# EAGLE design brushless sub driver 2 (EAGLE 9.6.2)
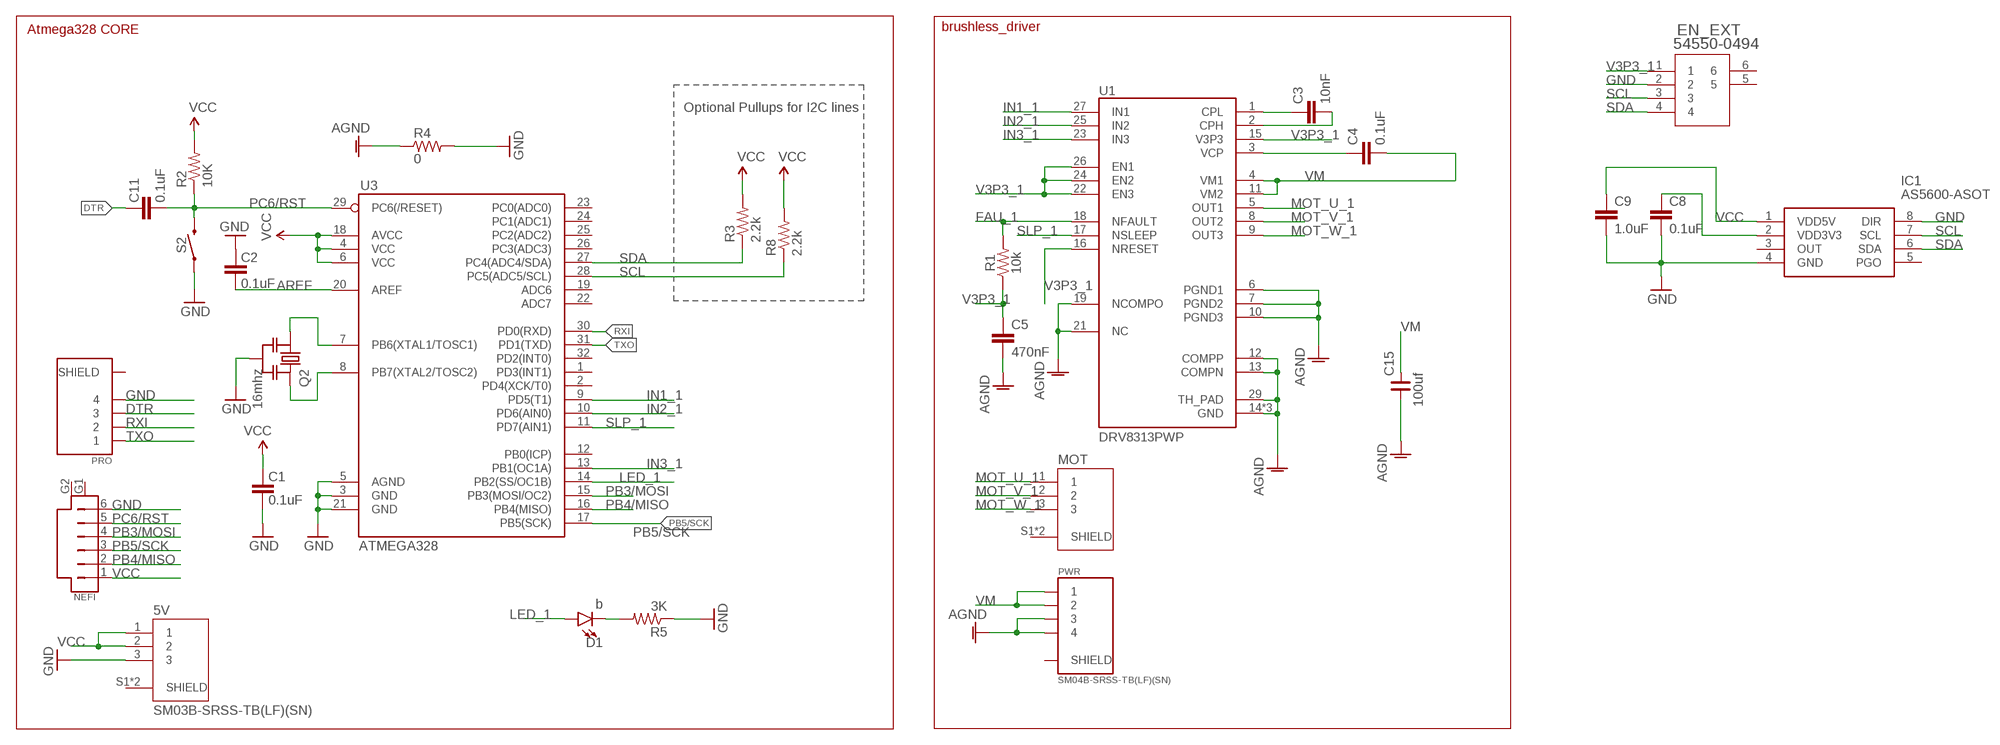
[diagram p0: schematic, sheet 1]

## Parts
5V  SM03B-SRSS-TB(LF)(SN)  [JST_SM03B-SRSS-TB(LF)(SN)]
C1  0.1uF  CAP0603-CAP  [0603-CAP]
C2  0.1uF  CAP0603-CAP  [0603-CAP]
C3  10nF  10NF-0603-50V-10%  [0603]
C4  0.1uF  0.1UF-0603-25V-(+80/-20%)  [0603]
C5  470nF  470NF-0603-10V-10%-X5R  [0603]
C8  0.1uF  0.1UF-0402-16V-10%  [0402]
C9  1.0uF  1.0UF-0402-16V-10%  [0402]
C11  0.1uF  CAP0603-CAP  [0603-CAP]
C15  100uf  C_1206  [C1206]
D1  b  LED0603  [LED-0603]
EN_EXT  54550-0494  [CON4_1X4_DRB2_MOL]
IC1  AS5600-ASOT  [SOIC127P600X175-8N]
MOT  SM03B-SRSS-TB(LF)(SN)  [JST_SM03B-SRSS-TB(LF)(SN)]
NEFI  SM06B-SRSS-TB  [SM06B]
PRO  SM04B-SRSS-TB(LF)(SN)  [JST_SM04B-SRSS-TB(LF)(SN)]
PWR  SM04B-SRSS-TB(LF)(SN)  [JST_SM04B-SRSS-TB(LF)(SN)]
Q2  16mhz  RESONATOR-MURATACST_CE  [RESONATOR_MURATA2]
R1  10k  10KOHM-0603-1/10W-1%  [0603]
R2  10K  RESISTOR0603-RES  [0603-RES]
R3  2.2k  RESISTOR0603-RES  [0603-RES]
R4  0  R_0603  [R0603]
R5  3K  RESISTOR0603-RES  [0603-RES]
R8  2.2k  RESISTOR0603-RES  [0603-RES]
S2  MOMENTARY-SWITCH-SPST-SMD-RIGHT-ANGLE  [TACTILE_SWITCH_SMD_RIGHT_ANGLE]
U1  DRV8313PWP  [SOP28P65_970X640X120L60X24T483X275N]
U3  ATMEGA328  ATMEGA168  [TQFP32-08]

## Nets
AGND: C5.2 C15.1 PWR.3 PWR.4 R4.1 U1.6(PGND1) U1.7(PGND2) U1.10(PGND3) U1.12(COMPP) U1.13(COMPN) U1.14(GND) U1.19(NCOMPO) U1.20(GND) U1.21(NC) U1.28(GND) U1.29(TH_PAD)
AREF: C2.1 U3.20(AREF)
DTR: C11.2 PRO.3
FAU_1: R1.2 U1.18(NFAULT)
GND: 5V.3 C1.1 C2.2 C8.2 C9.2 EN_EXT.2 IC1.4(GND) IC1.8(DIR) NEFI.6 PRO.4 Q2.2 R4.2 R5.1 S2.1 U3.3(GND) U3.5(AGND) U3.21(GND)
IN1_1: U1.27(IN1) U3.9(PD5(T1))
IN2_1: U1.25(IN2) U3.10(PD6(AIN0))
IN3_1: U1.23(IN3) U3.13(PB1(OC1A))
LED_1: D1.A U3.14(PB2(SS/OC1B))
MOT_U_1: MOT.1 U1.5(OUT1)
MOT_V_1: MOT.2 U1.8(OUT2)
MOT_W_1: MOT.3 U1.9(OUT3)
N$1: Q2.1 U3.7(PB6(XTAL1/TOSC1))
N$2: Q2.3 U3.8(PB7(XTAL2/TOSC2))
N$3: C3.1 U1.1(CPL)
N$4: C3.2 U1.2(CPH)
N$5: C4.1 U1.3(VCP)
N$6: C8.1 IC1.2(VDD3V3)
N$7: D1.C R5.2
PB3/MOSI: NEFI.4 U3.15(PB3(MOSI/OC2))
PB4/MISO: NEFI.2 U3.16(PB4(MISO))
PB5/SCK: NEFI.3 U3.17(PB5(SCK))
PC6/RST: C11.1 NEFI.5 R2.1 S2.2 U3.29(PC6(/RESET))
RXI: PRO.2 U3.30(PD0(RXD))
SCL: EN_EXT.3 IC1.7(SCL) R8.1 U3.28(PC5(ADC5/SCL))
SDA: EN_EXT.4 IC1.6(SDA) R3.1 U3.27(PC4(ADC4/SDA))
SLP_1: U1.17(NSLEEP) U3.11(PD7(AIN1))
TXO: PRO.1 U3.31(PD1(TXD))
V3P3_1: C5.1 EN_EXT.1 R1.1 U1.15(V3P3) U1.16(NRESET) U1.22(EN3) U1.24(EN2) U1.26(EN1)
VCC: 5V.1 5V.2 C1.2 C9.1 IC1.1(VDD5V) NEFI.1 R2.2 R3.2 R8.2 U3.4(VCC) U3.6(VCC) U3.18(AVCC)
VM: C4.2 C15.2 PWR.1 PWR.2 U1.4(VM1) U1.11(VM2)
Unconnected: 5V.S1(SHIELD) 5V.S2(SHIELD) EN_EXT.5 EN_EXT.6 IC1.3(OUT) IC1.5(PGO) MOT.S1(SHIELD) MOT.S2(SHIELD) NEFI.G1 NEFI.G2 PRO.S1(SHIELD) PRO.S2(SHIELD) PWR.S1(SHIELD) PWR.S2(SHIELD) U3.1(PD3(INT1)) U3.2(PD4(XCK/T0)) U3.12(PB0(ICP)) U3.19(ADC6) U3.22(ADC7) U3.23(PC0(ADC0)) U3.24(PC1(ADC1)) U3.25(PC2(ADC2)) U3.26(PC3(ADC3)) U3.32(PD2(INT0))

## Notes on the sheet
- Atmega328 CORE | brushless_driver
- Optional Pullups for I2C lines

## Library data of the parts
5V MOT = SM03B-SRSS-TB_LF__SN_:SM03B-SRSS-TB(LF)(SN): SH Series 3 Position 1 mm Pitch Surface Mount Side Entry Shrouded Header; AVAILABILITY: Unavailable; DESCRIPTION: Connector Header Surface Mount, Right Angle 3 position 0.039 _1.00mm_; MF: JST Sales; MP: SM03B-SRSS-TB_LF__SN_; PACKAGE: None; PRICE: None
C1 C2 C11 = SparkFun:CAP: Capacitor Standard 0603 ceramic capacitor, and 0.1" leaded capacitor.
C3 = SparkFun-Capacitors:10NF: 0.01uF/10nF/10,000pF ceramic capacitors A capacitor is a passive two-terminal electrical component used to store electrical energy temporarily in an electric field. CAP-09321; PROD_ID: CAP-00867
C4 = SparkFun-Capacitors:0.1UF: 0.1µF ceramic capacitors A capacitor is a passive two-terminal electrical component used to store electrical energy temporarily in an electric field.; PROD_ID: CAP-00810
C5 = SparkFun-Capacitors:470NF: 0.47uF/470nF ceramic capacitors A capacitor is a passive two-terminal electrical component used to store electrical energy temporarily in an electric field.; PROD_ID: CAP-13216
C8 = SparkFun-Capacitors:0.1UF: 0.1µF ceramic capacitors A capacitor is a passive two-terminal electrical component used to store electrical energy temporarily in an electric field.; PROD_ID: CAP-12416
C9 = SparkFun-Capacitors:1.0UF: 1µF ceramic capacitors A capacitor is a passive two-terminal electrical component used to store electrical energy temporarily in an electric field.; PROD_ID: CAP-12417
C15 = rc-master-smd:C_: NON-POLARIZED CAP
D1 = SparkFun-LED:LED: LED (Generic) Standard schematic elements and footprints for 5mm, 3mm, 1206, and 0603 sized LEDs. Generic LEDs with no color specified.
EN_EXT = fpc_4p_0.5:54550-0494; BUILT_BY: EMA_UL_Team; MANUFACTURER_PART_NUMBER: 54550-0494; SOURCELIBRARY: Molex_2010-01-01; VENDOR: Molex Connector Corporation
IC1 = AS5600-ASOT:AS5600-ASOT: Board Mount Hall Effect / Magnetic Sensors AS5600 Magnetic Sensor 12-Bit Source: Datasheet <http://www.ams.com/eng/content/download/639463/1698857/325295>; DESCRIPTION: Board Mount Hall Effect / Magnetic Sensors AS5600 Magnetic Sensor 12-Bit; HEIGHT: 1.75mm; MANUFACTURER_NAME: ams; MANUFACTURER_PART_NUMBER: AS5600-ASOT; MOUSER_PART_NUMBER: 985-AS5600-ASOT; MOUSER_PRICE-STOCK: https://www.mouser.com/Search/Refine.aspx?Keyword=985-AS5600-ASOT
NEFI = SM06B-SRSS-TB:SM06B-SRSS-TB: CONN HEADER SH 6POS SIDE 1MM TIN Check prices <https://snapeda.com/parts/SM06B-SRSS-TB/JST%20Sales/view-part/?ref=eda>; AVAILABILITY: Bad; DESCRIPTION: Connector Header Surface Mount, Right Angle 6 position 0.039 (1.00mm); MF: JST Sales; MP: SM06B-SRSS-TB; PACKAGE: None; PRICE: None
PRO PWR = SM04B-SRSS-TB_LF__SN_:SM04B-SRSS-TB(LF)(SN): SH Series 1.0 mm Pitch 2 Position Single Row Side Entry Shrouded Header Check prices <https://snapeda.com/parts/SM04B-SRSS-TB%28LF%29%28SN%29/JST%20Sales/view-part/?ref=eda>; ARROW_EUROPE-PURCHASE-URL: https://snapeda.com/shop?store=Arrow+Europe&id=557466; AVAILABILITY: Good; DESCRIPTION: Connector Header Surface Mount, Right Angle 4 position 0.039 (1.00mm); DIGIKEY-PURCHASE-URL: https://snapeda.com/shop?store=DigiKey&id=557466; MF: JST Sales; MP: SM04B-SRSS-TB(LF)(SN); PACKAGE: None; PRICE: None
Q2 = m-pad-2.1:RESONATOR-MURATA: Murata ceramic Resonator "ceralock" CSTCE series with built in load capacitance +- 0.5% tolerance 12.51MHz to 19.99MHz 16MHz murata part#: CSTCE16M0V53-R0 16MHz digikey part#: 490-1198-1-ND $1.33 each
R1 = SparkFun-Resistors:10KOHM: 10kΩ resistor A resistor is a passive two-terminal electrical component that implements electrical resistance as a circuit element. Resistors act to reduce current flow, and, at the same time, act to lower voltage levels within circuits. - Wikipedia; PROD_ID: RES-00824
R2 R3 R5 R8 = SparkFun:RESISTOR: Resistor Basic schematic elements and footprints for 0603, 1206, and PTH resistors.
R4 = rc-master-smd:R_: RESISTOR
S2 = SparkFun-Switches:MOMENTARY-SWITCH-SPST: Momentary Switch (Pushbutton) - SPST Normally-open (NO) SPST momentary switches (buttons, pushbuttons). Variants PTH-12MM - 12mm square, through-hole Momentary Pushbutton Switch - 12mm Square <https://www.sparkfun.com/products/9190> (COM-09190) PTH-6.0MM, PTH-6.0MM-KIT - 6.0mm square, through-hole Mini Pushbutton Switch <https://www.sparkfun.com/products/97> (COM-00097) KIT package intended for soldering kit's - only one side of pads' copper is exposed. PTH-RIGHT-ANGLE-KIT - Right-angle, through-hole Right Angle Tactile Button <https://www.sparkfun.com/products/10791> - Used on SparkFun BigTime Watch Kit <https://www.sparkfun.com/products/11734> SMD-12MM - 12mm square, surface-mount Tactile Button - SMD (12mm) <https://www.sparkfun.com/products/12993> (COM-12993) Used on SparkFun PicoBoard <https://www.sparkfun.com/products/11888> SMD-4.5MM - 4.5mm Square Trackball Switch Used on SparkFun Blackberry Trackballer Breakout <https://www.sparkfun.com/products/13169> SMD-4.6MMX2.8MM - 4.60mm x 2.80mm, surface mount Used on SparkFun SAMD21 Mini Breakout <https://www.sparkfun.com/products/13664> SMD-5.2MM, SMD-5.2-REDUNDANT - 5.2mm square, surface-mount Mini Pushbutton Switch - SMD <https://www.sparkfun.com/products/8720> (COM-08720) Used on Arduino Pro Mini <https://www.sparkfun.com/products/11114> REDUNDANT package connects both switch circuits together SMD-6.0X3.5MM - 6.0 x 3.5mm, surface mount Momentary Reset Switch SMD <https://www.sparkfun.com/products/8229> (COM-08229) SMD-6.2MM-TALL - 6.2mm square, surface mount Tactile Button - SMD (6mm) <https://www.sparkfun.com/products/12992> Used on SparkFun Digital Sandbox <https://www.sparkfun.com/products/12651> SMD-RIGHT-ANGLE - Right-angle, surface mount Used on SparkFun Block for Intel® Edison - Arduino <https://www.sparkfun.com/products/13036>; PROD_ID: COMP-12265
U1 = DRV8313PWP:DRV8313PWP: 2.5A Three Phase Brushless DC Motor Driver (PWM Ctrl) 28-HTSSOP -40 to 85; DESCRIPTION: 2.5A Three Phase Brushless DC Motor Driver _PWM Ctrl_ 28-HTSSOP -40 to 85; DIGI-KEY_PART_NUMBER: 296-35540-5-ND; DIGI-KEY_PURCHASE_URL: https://www.digikey.com.cn/product-detail/zh/texas-instruments/DRV8313PWP/296-35540-5-ND/3790947?utm_source=snapeda&utm_medium=aggregator&utm_campaign=symbol; MF: Texas Instruments; MP: DRV8313PWP; PACKAGE: HTSSOP-28 Texas Instruments
U3 = SparkFun:ATMEGA168

## Net classes
0 default: width 0.203 mm
1 vcc: width 0.254 mm

## Board
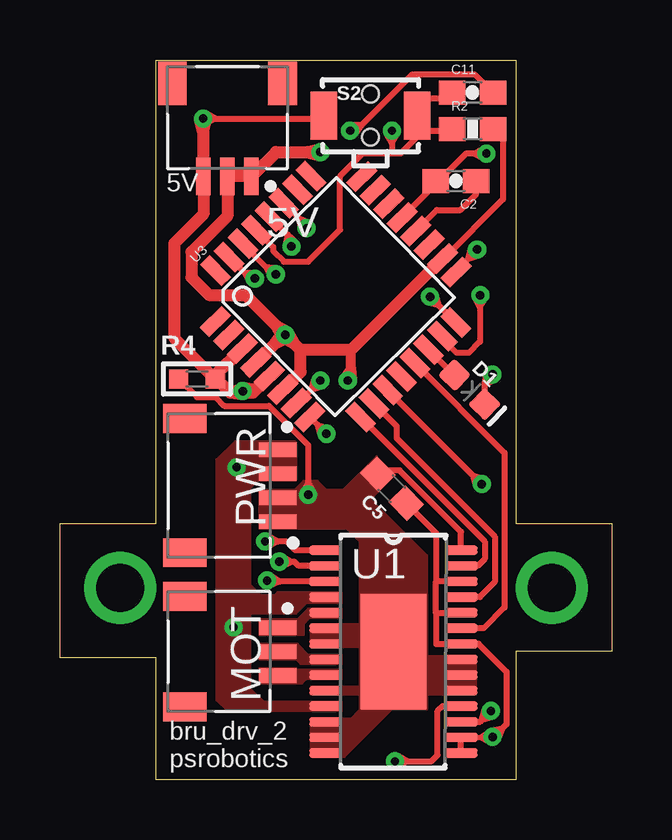
[diagram p1: board, top side]
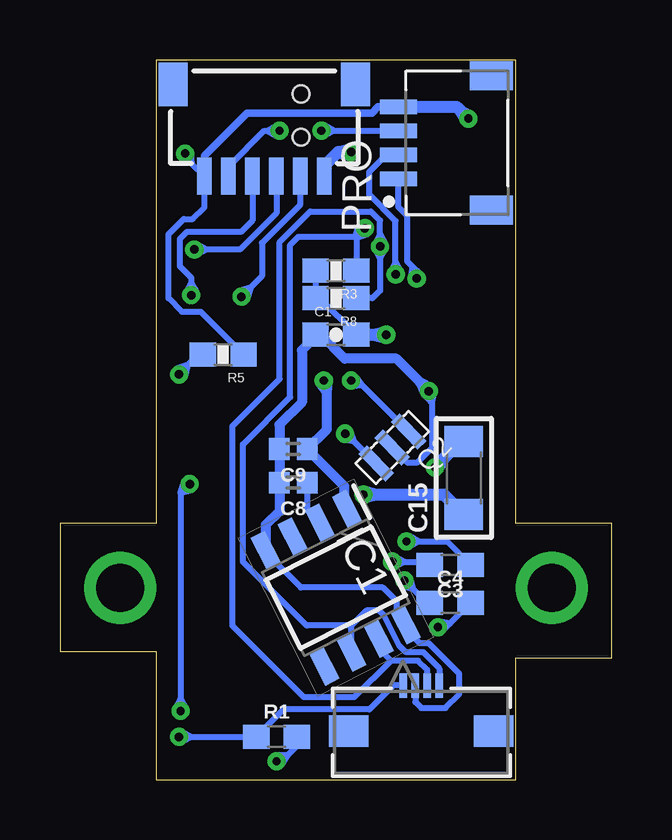
[diagram p2: board, bottom side, seen from below]

Size 23 x 30 mm. Coordinates in mm from the lower left corner, seen from the top.
Outline: 4,0 4,5.08 0,5.08 0,10.67 4,10.67 4,30 19,30 19,10.67 23,10.67 23,5.33 19,5.33 19,0 4,0
Copper layers (1*16): Top 0.035mm / dielectric 1.5mm / Bottom 0.035mm
Design rules "default *": minimum track width 6mil, minimum drill 0.35mm, track to track 4mil, track to pad 4mil, pad to pad 4mil, via to via 4mil, smd to smd 4mil, copper to edge 5mil, drill to drill 6mil, minimum pad ring 10mil, minimum via ring 8mil, stop-mask expansion 4mil, vias tented up to drill 15mil, thermal gap 10mil

### Footprints (pad centres in the part's own frame; a part is rotated, then mirrored left to right if it is on the bottom)
JST_SM03B-SRSS-TB(LF)(SN) = smd 0.6 x 1.55: 1 -1,0; 2 0,0; 3 1,0 | smd 1.2 x 1.8: S1 -2.3,-3.875; S2 2.3,-3.875
0603-CAP = smd 1.1 x 1: 1 -0.85,0; 2 0.85,0
0603 = smd 1.1 x 1: 1 -0.85,0; 2 0.85,0
0402 = smd 0.85 x 0.9: 1 -0.58,0; 2 0.58,0
C1206 = smd 1.3 x 1.6: 1 -1.524,0; 2 1.524,0
LED-0603 = smd 1 x 1: A -0.877,0; C 0.877,0
CON4_1X4_DRB2_MOL = smd 0.305 x 1.016: 1 0.75,-1.702; 2 0.25,-1.702; 3 -0.25,-1.702; 4 -0.75,-1.702 | smd 1.65 x 1.3: 5 -3.023,0.203; 6 3.023,0.203
SOIC127P600X175-8N = smd 1.5 x 0.65: 1 -2.7,1.905; 2 -2.7,0.635; 3 -2.7,-0.635; 4 -2.7,-1.905; 5 2.7,-1.905; 6 2.7,-0.635; 7 2.7,0.635; 8 2.7,1.905
SM06B = smd 0.6 x 1.55: 1 -2.5,2.275; 2 -1.5,2.275; 3 -0.5,2.275; 4 0.5,2.275; 5 1.5,2.275; 6 2.5,2.275 | smd 1.2 x 1.8: G1 -3.8,-1.55; G2 3.8,-1.55
JST_SM04B-SRSS-TB(LF)(SN) = smd 0.6 x 1.55: 1 -1.5,0; 2 -0.5,0; 3 0.5,0; 4 1.5,0 | smd 1.2 x 1.8: S1 -2.8,-3.875; S2 2.8,-3.875
RESONATOR_MURATA2 = smd 0.5 x 1.6: 1 -0.95,0; 2 0,0; 3 0.95,0
0603-RES = smd 1.1 x 1: 1 -0.85,0; 2 0.85,0
R0603 = smd 0.8 x 0.8: 1 -0.762,0; 2 0.762,0
TACTILE_SWITCH_SMD_RIGHT_ANGLE = smd 1.1 x 2: 1 -1.95,0; 2 1.95,0 | hole 0.7: 0,0.9; 0,-0.9
SOP28P65_970X640X120L60X24T483X275N = smd 1.37 x 0.39: 1 -2.82,4.225; 2 -2.82,3.575; 3 -2.82,2.925; 4 -2.82,2.275; 5 -2.82,1.625; 6 -2.82,0.975; 7 -2.82,0.325; 8 -2.82,-0.325; 9 -2.82,-0.975; 10 -2.82,-1.625; 11 -2.82,-2.275; 12 -2.82,-2.925; 13 -2.82,-3.575; 14 -2.82,-4.225; 15 2.82,-4.225; 16 2.82,-3.575; 17 2.82,-2.925; 18 2.82,-2.275; 19 2.82,-1.625; 20 2.82,-0.975; 21 2.82,-0.325; 22 2.82,0.325; 23 2.82,0.975; 24 2.82,1.625; 25 2.82,2.275; 26 2.82,2.925; 27 2.82,3.575; 28 2.82,4.225 | smd 2.75 x 4.83: 29 0,0
TQFP32-08 = smd 1.27 x 0.559: 1 -4.293,2.8; 2 -4.293,2; 3 -4.293,1.2; 4 -4.293,0.4; 5 -4.293,-0.4; 6 -4.293,-1.2; 7 -4.293,-2; 8 -4.293,-2.8; 17 4.293,-2.8; 18 4.293,-2; 19 4.293,-1.2; 20 4.293,-0.4; 21 4.293,0.4; 22 4.293,1.2; 23 4.293,2; 24 4.293,2.8 | smd 0.559 x 1.27: 9 -2.8,-4.293; 10 -2,-4.293; 11 -1.2,-4.293; 12 -0.4,-4.293; 13 0.4,-4.293; 14 1.2,-4.293; 15 2,-4.293; 16 2.8,-4.293; 25 2.8,4.293; 26 2,4.293; 27 1.2,4.293; 28 0.4,4.293; 29 -0.4,4.293; 30 -1.2,4.293; 31 -2,4.293; 32 -2.8,4.293

### Placement (x,y rotation side)
5V  6.98,25.15 180 top
C1  11.49,18.54 0 bottom
C2  16.51,24.96 180 top
C3  6.73,8.95 180 bottom
C4  6.73,7.37 0 bottom
C5  13.84,12.13 134.4 top
C8  13.27,12.38 180 bottom
C9  13.27,13.78 180 bottom
C11  17.21,28.64 0 top
C15  6.16,12.57 90 bottom
D1  17.08,16.26 315.8 top
EN_EXT  7.94,2.22 180 bottom
IC1  11.5,8 296.9 bottom
MOT  9.08,5.33 270 top
NEFI  14.48,27.43 180 bottom
PRO  8.89,26.54 90 bottom
PWR  9.08,12.26 270 top
Q2  9.14,13.84 224.6 bottom
R1  13.97,1.78 0 bottom
R2  17.21,27.11 0 top
R3  11.49,21.21 180 bottom
R4  5.71,16.7 0 top
R5  16.19,17.72 180 bottom
R8  11.49,20.07 180 bottom
S2  12.95,27.69 0 top
U1  13.91,5.33 0 top
U3  11.5,20.13 44.7 top

### Tracks (layer width: path | path; a pad name or v marks a point on that pad's centre or on a via)
AGND  (via drill 0.35)
  Top 0.254: U1.28 16.73,10.32 14.16,12.89 13.4,12.89 C5.2 | R4.1 5.71,15.94 6.49,15.94 6.85,15.58 8.71,15.58 10.35,13.95 10.35,12.4 | 10.35,12.4 v10.35,11.87 | 10.35,12.4 10.13,11.99 v10.35,11.87 | 10.35,12.4 10.57,11.99 v10.35,11.87
  Bottom 0.508: C15.1 6.98,11.87 9.82,11.87 | 9.82,11.87 v10.35,11.87 | 9.82,11.87 10.32,11.75 v10.35,11.87 | 9.82,11.87 10.32,11.99 v10.35,11.87
  pour Top (no thermals): 8.32,12.06 8.32,10.48 11.94,10.48 12.51,9.91 12.51,2.92 15.3,2.92 15.3,9.33 12.57,12.06
  pour Top (no thermals): 10.48,6.48 10.48,5.52 12.83,5.52 12.83,6.54 12.76,6.48
  pour Top (no thermals): 10.48,3.87 13.02,3.87 13.02,3.56 10.48,3.56
  pour Top (no thermals): 10.48,2.54 12.13,2.54 12.51,2.92 13.84,2.92 11.87,0.95 10.48,0.95
  pour Top (no thermals): 13.21,13.46 13.97,12.7 12.19,10.92 11.68,10.92 11.68,11.94
  pour Top (no thermals): 17.34,5.14 17.34,3.56 15.11,3.56 15.11,5.14
  pour Top (no thermals): 9.78,11.3 9.78,12.06 10.16,12.45 10.73,12.45 11.18,12 11.18,11.3
AREF
  Top 0.254: U3.20 15.72,23.75 16.7,23.75 17.36,24.41 C2.1
DTR  (via drill 0.35)
  Top 0.254: v12.1,27.05 12.35,27.05 12.57,27.28 | 12.57,27.28 14.69,29.4 17.3,29.4 C11.2 | 12.57,27.28 12.11,27.3 v12.1,27.05 | 12.57,27.28 12.3,26.9 v12.1,27.05
  Bottom 0.254: PRO.3 11.57,27.05 | v12.1,27.05 11.57,27.05 | 11.57,27.05 11.98,26.83 v12.1,27.05 | 11.57,27.05 11.98,27.27 v12.1,27.05
FAU_1  (via drill 0.35)
  Top 0.254: v13.97,0.76 14.49,0.76 | 14.49,0.76 15.49,0.76 15.75,1.02 15.75,2.86 15.95,3.06 U1.18 | 14.49,0.76 14.09,0.98 v13.97,0.76 | 14.49,0.76 14.09,0.54 v13.97,0.76
  Bottom 0.254: v13.97,0.76 13.76,0.76 13.51,1.01 | 13.51,1.01 13.12,1.4 R1.2 | 13.51,1.01 13.76,0.62 v13.97,0.76 | 13.51,1.01 13.97,1.01 v13.97,0.76
GND  (via drill 0.35)
  Top 0.254: U3.21 15.66,24.82 | 15.66,24.82 C2.2 | v17.78,26.1 17.25,26.1 | 17.25,26.1 16.94,26.1 15.66,24.82 | v5.97,27.56 6.49,27.56 | 6.49,27.56 10.88,27.56 | 17.25,26.1 17.66,25.88 v17.78,26.1 | 17.25,26.1 17.66,26.32 v17.78,26.1 | 6.49,27.56 6.09,27.78 v5.97,27.56 | 6.49,27.56 6.09,27.34 v5.97,27.56
  Top 0.508: R4.2 4.76,18.41 4.76,22.35 5.98,23.57 5V.3 5.97,25.16 5.97,27.03 | U3.3 6.48,16.84 | 6.54,16.7 7.1,16.14 | 7.1,16.14 7.11,16.13 7.62,16.13 | 7.62,16.13 8.03,16.13 8.14,16.24 | 8.14,16.24 U3.5 | v5.97,27.56 5.97,27.03 | 10.88,27.56 S2.1 | v7.62,16.19 7.62,16.13 | 5.97,27.03 6.09,27.53 v5.97,27.56 | 5.97,27.03 5.85,27.53 v5.97,27.56 | 7.1,16.14 7.6,16.07 v7.62,16.19 | 7.1,16.14 7.58,16.31 v7.62,16.19 | 8.14,16.24 7.64,16.32 v7.62,16.19 | 8.14,16.24 7.66,16.07 v7.62,16.19
  Top 0.61: 6.48,16.84 R4.2 6.54,16.7
  Bottom 0.254: EN_EXT.2 8.19,3.23 7.94,2.98 6.92,2.98 6.35,3.56 6.35,4.41 7.63,5.69 8.01,5.69 8.58,6.26 IC1.8 8.95,6.83 8.95,7.43 9.52,8 12.95,8 14.42,9.47 IC1.4 | 17.48,25.66 NEFI.6 16.98,23.85 17.46,23.37 17.84,23.37 18.48,22.73 18.48,20.07 17.91,19.49 17.12,19.49 R5.1 | 17.48,25.66 17.78,25.96 v17.78,26.1 | C1.1 12.34,18.48 | v7.62,16.19 7.5,16.07 7.5,15.68 | 7.5,15.68 7.5,13.83 8.12,13.21 8.51,13.21 Q2.2 | 17.48,25.66 17.89,25.88 v17.78,26.1 | 17.48,25.66 17.53,26.12 v17.78,26.1 | 7.5,15.68 7.81,16.02 v7.62,16.19 | 7.5,15.68 7.38,16.13 v7.62,16.19
  Bottom 0.305: PRO.4 9.73,28.04 9.98,27.79 15.2,27.79 16.98,26.01 NEFI.6
  Bottom 0.406: IC1.4 14.42,10.62 13.85,11.18 C8.2 C9.2 13.85,14.79 12.91,15.73 12.91,17.91 12.34,18.48 | C1.1 12.12,18.54 11.13,17.55 8.97,17.55 7.99,16.56 | v7.62,16.19 7.99,16.56 | 7.99,16.56 7.54,16.35 v7.62,16.19 | 7.99,16.56 7.78,16.12 v7.62,16.19
  Bottom 0.508: PRO.4 6.45,28.04 6.34,27.93 | 6.34,27.93 v5.97,27.56 | 6.34,27.93 5.9,27.66 v5.97,27.56 | 6.34,27.93 6.08,27.49 v5.97,27.56
IN1_1
  Top 0.254: U3.9 17.72,9.92 17.72,9.21 17.42,8.91 U1.27
IN2_1
  Top 0.254: U3.10 14.03,14.74 14.03,14.23 18.13,10.13 18.13,8.23 17.51,7.61 U1.25
IN3_1
  Top 0.254: U3.13 18.54,13.62 18.54,7.18 17.68,6.31 U1.23
LED_1
  Top 0.254: D1.A 16.43,16.87 U3.14
MOT_U_1
  pour Top (no thermals): 8.32,6.67 9.91,6.67 10.35,7.11 11.75,7.11 11.75,6.73 10.41,6.73 10.16,6.48 10.16,6.03 8.32,6.03
MOT_V_1
  pour Top (no thermals): 8.32,5.65 9.91,5.65 10.35,5.21 11.75,5.21 11.75,4.83 10.03,4.83 9.84,5.02 8.32,5.02
MOT_W_1
  pour Top (no thermals): 8.32,4.64 9.84,4.64 9.91,4.57 11.75,4.57 11.75,4.19 10.29,4.19 10.1,4 8.32,4
N$1  (via drill 0.35)
  Top 0.203: 9.91,15.69 U3.7
  Top 0.254: v10.86,16.64 10.49,16.27 | 10.49,16.27 9.91,15.69 | 10.49,16.27 10.93,16.4 v10.86,16.64 | 10.49,16.27 10.62,16.71 v10.86,16.64
  Bottom 0.254: Q2.1 10.38,16.42 | 10.38,16.42 10.59,16.64 v10.86,16.64 | 10.38,16.42 10.84,16.39 v10.86,16.64 | 10.38,16.42 10.66,16.79 v10.86,16.64
N$2  (via drill 0.35)
  Top 0.203: 10.42,15.11 U3.8
  Top 0.254: v11.11,14.41 10.74,14.79 | 10.74,14.79 10.42,15.11 | 10.74,14.79 10.87,14.34 v11.11,14.41 | 10.74,14.79 11.18,14.65 v11.11,14.41
  Bottom 0.203: 11.06,14.41 v11.11,14.41
  Bottom 0.254: Q2.3 10.71,14.07 | 10.71,14.07 11.06,14.41 | 10.71,14.07 11.16,14.17 v11.11,14.41 10.88,14.5 10.71,14.07
N$3  (via drill 0.35)
  Top 0.254: U1.1 9.81,9.56 9.44,9.93 9.08,9.93 | 9.08,9.93 v8.55,9.93 | 9.08,9.93 8.67,10.15 v8.55,9.93 | 9.08,9.93 8.67,9.71 v8.55,9.93
  Bottom 0.254: v8.55,9.93 8.03,9.93 | 8.03,9.93 6.85,9.93 C3.1 | 8.03,9.93 8.43,9.71 v8.55,9.93 | 8.03,9.93 8.43,10.15 v8.55,9.93
N$4  (via drill 0.35)
  Top 0.254: U1.2 9.95,8.91 9.78,9.08 9.67,9.08 | 9.67,9.08 v9.14,9.08 | 9.67,9.08 9.26,9.3 v9.14,9.08 | 9.67,9.08 9.26,8.86 v9.14,9.08
  Bottom 0.254: v9.14,9.08 8.62,9.08 | 8.62,9.08 7.71,9.08 C3.2 | 8.62,9.08 9.02,8.86 v9.14,9.08 | 8.62,9.08 9.02,9.3 v9.14,9.08
N$5  (via drill 0.35)
  Top 0.254: U1.3 9.16,8.26 | 9.16,8.26 8.68,8.26 v8.64,8.3 | 9.16,8.26 8.77,8.51 v8.64,8.3 | 9.16,8.26 8.74,8.07 v8.64,8.3
  Bottom 0.254: v8.64,8.3 8.26,7.93 | 8.26,7.93 7.68,7.35 7.68,7.37 C4.1 | 8.26,7.93 8.71,8.06 v8.64,8.3 | 8.26,7.93 8.39,8.37 v8.64,8.3
N$6
  Bottom 0.254: C8.1 12.69,11.23 IC1.2
N$7  (via drill 0.35)
  Top 0.254: D1.C 17.71,16.48 | 17.71,16.48 17.71,16.57 v18.03,16.89 | 17.71,16.48 18.13,16.66 v18.03,16.89 | 17.71,16.48 17.79,16.93 v18.03,16.89
  Bottom 0.254: v18.03,16.89 18.03,16.92 17.68,17.27 | 17.68,17.27 17.23,17.72 R5.2 | 17.68,17.27 17.79,16.83 v18.03,16.89 | 17.68,17.27 18.11,17.13 v18.03,16.89
N$8  (via drill 2)
  other vias: 2.5,8
N$9  (via drill 2)
  other vias: 20.5,8
PB3/MOSI  (via drill 0.35)
  Top 0.254: U3.15 15.94,18.39 16.54,17.79 17.05,17.79 17.51,18.25 17.51,19.67 | v17.52,20.19 17.51,20.18 17.51,19.67 | 17.51,19.67 17.74,20.07 v17.52,20.19 | 17.51,19.67 17.3,20.08 v17.52,20.19
  Bottom 0.254: NEFI.4 14.98,23.31 15.46,22.83 17.71,22.83 18.01,22.54 18.01,21.4 17.52,20.92 17.52,20.72 | 17.52,20.72 v17.52,20.19 | 17.52,20.72 17.3,20.31 v17.52,20.19 | 17.52,20.72 17.75,20.31 v17.52,20.19
PB4/MISO  (via drill 0.35)
  Top 0.254: 15.8,19.76 U3.16 | 15.8,19.76 v15.43,20.13 | 15.8,19.76 15.67,20.2 v15.43,20.13 | 15.8,19.76 15.36,19.89 v15.43,20.13
  Bottom 0.254: 15.06,20.5 14.58,20.98 14.58,22.37 12.97,23.98 NEFI.2 | 15.06,20.5 v15.43,20.13 | 15.06,20.5 15.19,20.06 v15.43,20.13 | 15.06,20.5 15.5,20.37 v15.43,20.13
PB5/SCK  (via drill 0.35)
  Top 0.254: v17.4,22.1 17.03,21.73 | 17.03,21.73 16.52,21.22 U3.17 | 17.03,21.73 17.47,21.86 v17.4,22.1 | 17.03,21.73 17.16,22.17 v17.4,22.1
  Bottom 0.254: NEFI.3 13.98,23.61 15.49,22.1 16.87,22.1 | 16.87,22.1 v17.4,22.1 | 16.87,22.1 17.28,21.88 v17.4,22.1 | 16.87,22.1 17.28,22.32 v17.4,22.1
PC6/RST  (via drill 0.35)
  Top 0.254: U3.29 8.89,22.21 8.89,22.04 9.33,21.59 10.35,21.59 11.68,22.92 11.68,25.16 12.62,26.1 13.84,26.1 | S2.2 14.9,26.8 14.21,26.1 13.84,26.1 | S2.2 14.9,28.38 16.1,28.38 C11.1 | S2.2 14.9,27.05 16.29,27.05 R2.1 | v13.84,27.05 13.84,26.53 | 13.84,26.53 13.84,26.1 | 13.84,26.53 14.06,26.93 v13.84,27.05 | 13.84,26.53 13.62,26.93 v13.84,27.05
  Bottom 0.254: NEFI.5 15.98,25.28 15.95,25.31 15.95,25.58 14.48,27.05 14.37,27.05 | 14.37,27.05 v13.84,27.05 | 14.37,27.05 13.96,27.27 v13.84,27.05 | 14.37,27.05 13.96,26.83 v13.84,27.05
RXI  (via drill 0.35)
  Top 0.254: U3.30 8.58,21.38 | 8.58,21.38 8.9,21.07 v9,21.07 | 8.58,21.38 8.77,20.96 v9,21.07 | 8.58,21.38 9.04,21.31 v9,21.07
  Bottom 0.254: v9,21.07 9,21.59 | 9,21.59 9,23.29 10.1,24.38 10.1,25.34 9.39,26.04 PRO.2 | 9,21.59 8.78,21.19 v9,21.07 | 9,21.59 9.22,21.19 v9,21.07
SCL  (via drill 0.35)
  Top 0.254: U3.28 9.5,22.73 | 9.5,22.73 9.65,22.57 v9.65,22.23 | 9.5,22.73 9.41,22.28 v9.65,22.23 | 9.5,22.73 9.83,22.4 v9.65,22.23
  Bottom 0.254: EN_EXT.3 7.69,4.58 8.06,4.95 9.21,4.95 | 9.21,4.95 9.71,5.46 IC1.7 | v9.65,22.23 9.65,21.7 | 9.65,21.7 9.65,20.38 9.97,20.07 R8.1 | 9.21,4.95 10.73,3.43 12.83,3.43 15.81,6.41 15.81,14.73 13.84,16.7 13.84,22.42 12.57,23.69 10.03,23.69 9.65,23.3 9.65,22.75 | v9.65,22.23 9.65,22.75 | 9.65,21.7 9.87,22.11 v9.65,22.23 | 9.65,21.7 9.43,22.11 v9.65,22.23 | 9.65,22.75 9.43,22.34 v9.65,22.23 | 9.65,22.75 9.87,22.34 v9.65,22.23
SDA  (via drill 0.35)
  Top 0.254: U3.27 9.96,23.4 | 9.96,23.4 10.29,23.07 v10.29,22.99 | 9.96,23.4 10.04,22.94 v10.29,22.99 | 9.96,23.4 10.38,23.22 v10.29,22.99
  Bottom 0.254: EN_EXT.4 7.18,3.93 7.18,4.63 7.85,5.31 8.57,5.31 8.84,5.58 9.49,6.85 9.69,7.05 10.22,7.05 10.84,6.43 | IC1.6 10.84,6.43 | v10.29,22.99 10.64,22.63 | 10.64,22.63 10.64,22.6 | 10.64,22.6 R3.1 | 10.84,6.43 12.69,6.43 12.7,6.41 15.37,9.08 15.37,13.97 13.4,15.94 13.4,22.29 13.06,22.63 10.67,22.63 | 10.67,22.63 10.64,22.63 | 10.64,22.6 10.53,23.05 v10.29,22.99 | 10.64,22.6 10.21,22.75 v10.29,22.99 | 10.67,22.63 10.53,23.07 v10.29,22.99 | 10.67,22.63 10.22,22.74 v10.29,22.99
SLP_1  (via drill 0.35)
  Top 0.203: v17.58,12.32 v17.59,12.32
  Top 0.254: U1.17 17.52,2.41 17.6,2.49 | 17.6,2.49 v17.97,2.86 | U3.11 17.21,12.69 | 17.21,12.69 v17.58,12.32 | 17.6,2.49 18.04,2.62 v17.97,2.86 | 17.6,2.49 17.73,2.93 v17.97,2.86 | 17.21,12.69 17.35,12.25 v17.59,12.32 17.66,12.56 17.21,12.69
  Bottom 0.254: v17.59,12.32 17.96,11.95 | 17.96,11.95 17.97,11.94 17.97,3.38 | 17.97,3.38 v17.97,2.86 | 17.97,3.38 17.75,2.98 v17.97,2.86 | 17.97,3.38 18.19,2.98 v17.97,2.86 | 17.96,11.95 17.83,12.39 v17.59,12.32 | 17.96,11.95 17.52,12.08 v17.59,12.32
TXO  (via drill 0.35)
  Top 0.254: U3.31 7.67,21.16 | 7.67,21.16 7.94,20.89 v8.13,20.89 | 7.67,21.16 7.91,20.76 v8.13,20.89 | 7.67,21.16 8.14,21.14 v8.13,20.89
  Bottom 0.254: v8.13,20.89 8.13,21.21 8.3,21.39 | PRO.1 8.89,23.87 8.52,23.5 8.52,21.6 8.3,21.39 | 8.3,21.39 7.96,21.08 v8.13,20.89 | 8.3,21.39 8.38,20.93 v8.13,20.89
V3P3_1  (via drill 0.35)
  Top 0.203: U1.16 17.51,1.76 | 17.51,1.76 18.01,1.76 v18.03,1.78 | v18.03,1.78 18.09,1.78 | 17.51,1.76 17.9,1.54 v18.03,1.78 | 17.51,1.76 17.88,2.01 v18.03,1.78
  Top 0.254: U1.26 15.68,8.26 | C5.1 15.68,10.27 15.68,8.26 | U1.24 16.7,6.93 15.68,6.93 | 15.68,6.93 15.68,8.26 | 15.68,6.93 15.68,5.65 16.72,5.65 U1.22 17.45,5.66 18.62,4.5 18.62,2.3 18.43,2.12 | U1.15 U1.16 | 18.43,2.12 18.09,1.78 | 18.43,2.12 17.98,2.02 v18.03,1.78 18.27,1.69 18.43,2.12
  Bottom 0.254: v18.03,1.78 17.51,1.78 | 17.51,1.78 R1.1 13.68,2.92 10.1,2.92 9.09,3.92 EN_EXT.1 | 17.51,1.78 17.91,1.56 v18.03,1.78 | 17.51,1.78 17.91,2 v18.03,1.78
VCC  (via drill 0.35)
  Top 0.254: 8.19,17.39 U3.4 | R2.2 18.48,26.7 18.48,24.19 16.01,21.73 U3.18
  Top 0.406: v12,16.64 12.14,16.77 12.14,17.14 | 12.14,17.14 12.14,17.91 | 12.14,17.14 11.86,16.74 v12,16.64 | 12.14,17.14 12.18,16.65 v12,16.64
  Top 0.508: v9.4,18.54 9.33,18.54 9,18.2 | 9,18.2 8.19,17.39 | U3.6 10.03,17 10.03,17.91 | 10.03,17.91 9.77,18.17 | 9.77,18.17 v9.4,18.54 | U3.18 12.14,17.91 10.03,17.91 | 9.03,18.91 7.73,20.21 6.21,20.21 5.49,20.93 5.49,22 6.98,23.5 5V.2 5V.1 9,26.16 10.33,26.16 | 9.03,18.91 v9.4,18.54 | 10.33,26.16 v10.86,26.16 | 9,18.2 9.45,18.43 v9.4,18.54 | 9,18.2 9.3,18.61 v9.4,18.54 | 9.77,18.17 9.5,18.61 v9.4,18.54 | 9.77,18.17 9.33,18.44 v9.4,18.54 | 9.03,18.91 9.29,18.48 v9.4,18.54 | 9.03,18.91 9.46,18.65 v9.4,18.54 | 10.33,26.16 10.83,26.04 v10.86,26.16 | 10.33,26.16 10.83,26.28 v10.86,26.16
  Bottom 0.254: R3.2 R8.2 12.17,20.07 C1.2
  Bottom 0.406: IC1.1 11.15,11.4 11.15,12.24 C9.1 11.87,14.6 11.87,16.13 | v12,16.64 11.87,16.51 11.87,16.13 | 11.87,16.13 12.15,16.54 v12,16.64 | 11.87,16.13 11.83,16.62 v12,16.64
  Bottom 0.508: C1.2 9.92,18.54 | 9.92,18.54 v9.4,18.54 | v10.86,26.16 11.38,26.16 | 11.38,26.16 11.41,26.16 11.98,25.59 NEFI.1 | 9.92,18.54 9.43,18.66 v9.4,18.54 | 9.92,18.54 9.43,18.42 v9.4,18.54 | 11.38,26.16 10.89,26.28 v10.86,26.16 | 11.38,26.16 10.89,26.04 v10.86,26.16
VM  (via drill 0.35)
  Bottom 0.254: v7.24,6.35 6.9,6.35 6.74,6.51 | 6.74,6.51 C4.2 | 6.74,6.51 7.06,6.18 v7.24,6.35 | 6.74,6.51 7.19,6.6 v7.24,6.35
  Bottom 0.508: C15.2 6.29,14.1 6.99,13.39 | 6.99,13.39 v7.37,13.02 | 6.99,13.39 7.26,12.95 v7.37,13.02 | 6.99,13.39 7.43,13.12 v7.37,13.02
  pour Top (no thermals): 9.84,14.1 7.3,14.1 6.54,13.34 6.54,3.3 6.98,2.86 11.75,2.86 11.75,3.24 8.51,3.24 7.94,3.81 7.94,12.13 8.32,12.51 9.84,12.51
  pour Top (no thermals): 11.75,7.81 9.08,7.81 8.95,7.68 8.38,7.68 7.94,8.13 6.54,8.13 6.54,6.86 7.81,6.86 7.87,6.92 9.84,6.92 10.29,7.37 11.75,7.37

### Text on the board
tPlace: 5V | bru_drv_2 / psrobotics